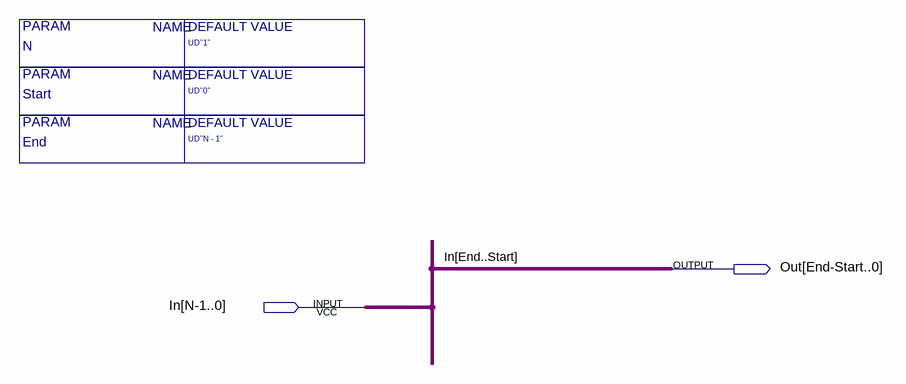
[diagram p0: schematic sheet]
// Quartus schematic SubWire.bdf as structural Verilog: 0 symbols, 2 pins
module SubWire #(parameter Start = "UD\"0\"", parameter End = "UD\"N - 1\"", parameter N = "UD\"1\"") (
  input  \In[N-1..0] ,
  output \Out[End-Start..0] 
);


  assign \Out[End-Start..0]  = \In[N-1..0] ;

  // Other names for the same wires on the sheet: In[End..Start] = \In[N-1..0] 
endmodule
